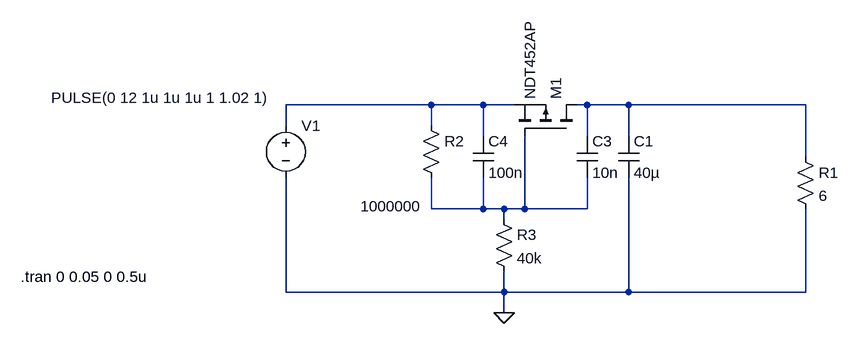
[diagram p0: schematic Soft_Start_Circuit_V2.asc]
Soft_Start_Circuit_V2.asc, the LTspice schematic file:
Version 4.1
SHEET 1 880 680
WIRE 112 80 -112 80
WIRE 192 80 112 80
WIRE 240 80 192 80
WIRE 352 80 336 80
WIRE 416 80 352 80
WIRE 688 80 416 80
WIRE -112 112 -112 80
WIRE 112 112 112 80
WIRE 192 128 192 80
WIRE 352 128 352 80
WIRE 416 128 416 80
WIRE 688 160 688 80
WIRE 112 240 112 192
WIRE 192 240 192 192
WIRE 192 240 112 240
WIRE 224 240 192 240
WIRE 256 240 256 128
WIRE 256 240 224 240
WIRE 352 240 352 192
WIRE 352 240 256 240
WIRE 224 256 224 240
WIRE -112 368 -112 192
WIRE 224 368 224 336
WIRE 224 368 -112 368
WIRE 416 368 416 192
WIRE 416 368 224 368
WIRE 688 368 688 240
WIRE 688 368 416 368
WIRE 224 400 224 368
FLAG 224 400 0
SYMBOL voltage -112 96 R0
WINDOW 123 0 0 Left 0
WINDOW 39 0 0 Left 0
WINDOW 3 -361 -27 Left 2
SYMATTR Value PULSE(0 12 1u 1u 1u 1 1.02 1)
SYMATTR InstName V1
SYMBOL cap 400 128 R0
SYMATTR InstName C1
SYMATTR Value 40µ
SYMBOL res 672 144 R0
SYMATTR InstName R1
SYMATTR Value 6
SYMBOL pmos 336 128 M270
SYMATTR InstName M1
SYMATTR Value NDT452AP
SYMBOL res 96 96 R0
WINDOW 3 -93 140 Left 2
SYMATTR Value 1000000
SYMATTR InstName R2
SYMBOL res 208 240 R0
SYMATTR InstName R3
SYMATTR Value 40k
SYMBOL cap 336 128 R0
SYMATTR InstName C3
SYMATTR Value 10n
SYMBOL cap 176 128 R0
SYMATTR InstName C4
SYMATTR Value 100n
TEXT -520 344 Left 2 !.tran 0 0.05 0 0.5u

The netlist it stands for:
* Soft_Start_Circuit_V2.asc
V1 N001 0 PULSE(0 12 1u 1u 1u 1 1.02 1)
C1 N002 0 40µ
R1 N002 0 6
M1 N002 N003 N001 N001 NDT452AP
R2 N001 N003 1000000
R3 N003 0 40k
C3 N002 N003 10n
C4 N001 N003 100n
.model NMOS NMOS
.model PMOS PMOS
.lib standard.mos
.tran 0 0.05 0 0.5u
.backanno
.end